# EAGLE design ChiefMarleySousViderev1 (EAGLE 5.11)
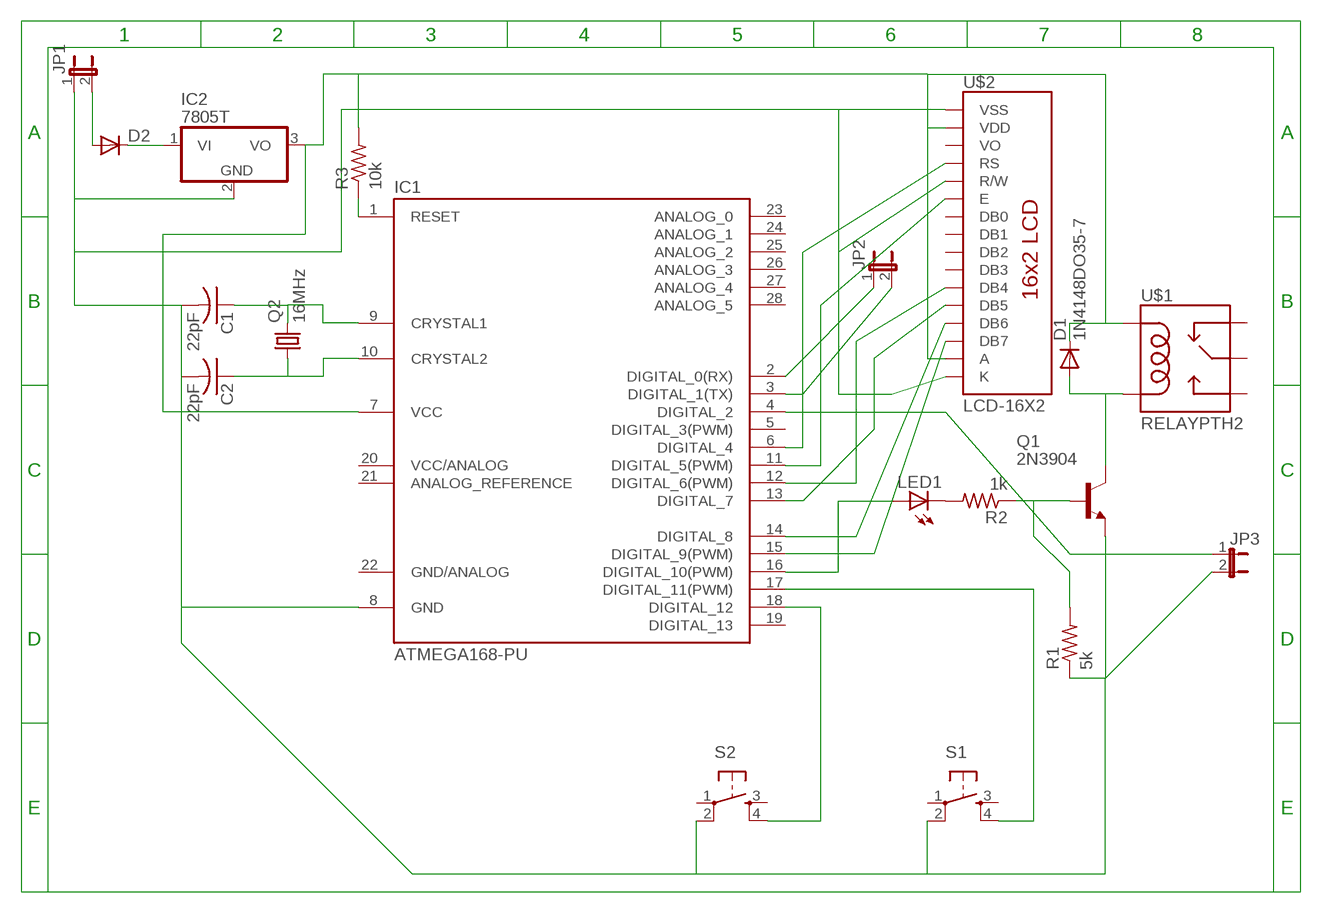
[diagram p0: schematic, sheet 1]

## Parts
C1  22pF  C-US025-025X050  [C025-025X050]
C2  22pF  C-US025-025X050  [C025-025X050]
D1  1N4148DO35-7  [DO35-7]
D2  DIODEPTH  [DIODE-1N4001]
IC1  ATMEGA168-PU  [DIL28-3]
IC2  7805T  [TO220H]
JP1  JUMPER-2PTH  [1X02]
JP2  JUMPER-2PTH  [1X02]
JP3  JP1E  [JP1]
LED1  LED3MM  [LED3MM]
Q1  2N3904  [TO92]
Q2  16MHz  CRYSTALHC49US  [HC49US]
R1  5k  R-US_0204/7  [0204/7]
R2  1k  R-US_0204/7  [0204/7]
R3  10k  R-US_0207/10  [0207/10]
S1  TAC_SWITCHPTH  [TACTILE-PTH]
S2  TAC_SWITCHPTH  [TACTILE-PTH]
U$1  RELAYPTH2  [RELAY-T9A]
U$2  LCD-16X2  [LCD-16X2]

## Nets
N$1: D1.A Q1.1(C) U$1.COIL2
N$2: D1.C IC1.7(VCC) IC2.3(VO) R3.2 U$1.COIL1 U$2.2(VDD) U$2.15(A)
N$3: Q1.2(B) R1.2 R2.1
N$4: IC1.2(DIGITAL_0(RX)) JP2.1
N$5: D2.A JP1.2
N$6: C1.1 IC1.9(CRYSTAL1) Q2.2
N$7: C2.1 IC1.10(CRYSTAL2) Q2.1
N$8: IC1.12(DIGITAL_6(PWM)) U$2.11(DB4)
N$9: IC1.6(DIGITAL_4) U$2.4(RS)
N$10: LED1.K(C) R2.2
N$11: IC1.18(DIGITAL_12) S2.4
N$12: IC1.17(DIGITAL_11(PWM)) S1.4
N$13: IC1.16(DIGITAL_10(PWM)) LED1.A
N$14: IC1.11(DIGITAL_5(PWM)) U$2.6(E)
N$15: IC1.13(DIGITAL_7) U$2.12(DB5)
N$16: IC1.14(DIGITAL_8) U$2.13(DB6)
N$17: IC1.15(DIGITAL_9(PWM)) U$2.14(DB7)
N$18: IC1.4(DIGITAL_2) JP3.1
N$19: IC1.1(RESET) R3.1
N$20: D2.C IC2.1(VI)
N$21: C1.2 C2.2 IC1.8(GND) IC2.2(GND) JP1.1 JP3.2 Q1.3(E) R1.1 S1.2 S2.2 U$2.1(VSS) U$2.5(R/W) U$2.16(K)
N$22: IC1.3(DIGITAL_1(TX)) JP2.2
Unconnected: IC1.5(DIGITAL_3(PWM)) IC1.19(DIGITAL_13) IC1.20(VCC/ANALOG) IC1.21(ANALOG_REFERENCE) IC1.23(ANALOG_0) IC1.24(ANALOG_1) IC1.25(ANALOG_2) IC1.26(ANALOG_3) IC1.27(ANALOG_4) IC1.28(ANALOG_5) S1.1 S1.3 S2.1 S2.3 U$1.MAIN U$1.NC U$1.NO U$2.3(VO) U$2.7(DB0) U$2.8(DB1) U$2.9(DB2) U$2.10(DB3)

## Power pins joined to a net without a drawn wire
GND/ANALOG: IC1.22(GND/ANALOG)

## Library data of the parts
C1 C2 = rcl:C-US: CAPACITOR, American symbol
D1 = diode:1N4148: DIODE high speed (Philips)
D2 = SparkFun:DIODE: Diode These are standard reverse protection diodes and small signal diodes. SMA package can handle up to about 1A. SOD-323 can handle about 200mA. What the SOD-323 package when ordering, there are some mfgs out there that are 5-pin packages.
IC1 = Arduino-AVR:ATMEGA168-PU
IC2 = linear:78*: Positive VOLTAGE REGULATOR Source: http://cache.national.com/ds/LM/LM78L05.pdf http://www.fairchildsemi.com/ds/LM/LM7805.pdf
JP1 JP2 = SparkFun:JUMPER-2: Jumper Basic 0.1" spaced jumper. Use with breakaway headers.
JP3 = jumper:JP1E: JUMPER
LED1 = SparkFun:LED: LEDs Standard schematic elements and footprints for 5mm, 3mm, 1206, and 0603 sized LEDs. 5mm - Spark Fun Electronics SKU : COM-00529 (and others)
Q1 = transistor-npn:2N3904: NPN Transistor
Q2 = SparkFun:CRYSTAL: Crystals Various standard crystals. Proven footprints. Spark Fun Electronics SKU : COM-00534
R1 R2 = rcl:R-US_: RESISTOR, American symbol
R3 = resistor:R-US_: RESISTOR, American symbol
S1 S2 = SparkFun:TAC_SWITCH: Momentary Switch Button commonly used for reset or general input. Spark Fun Electronics SKU : COM-00097
U$1 = SparkFun:RELAY
U$2 = SparkFun:LCD-16X2

## Board
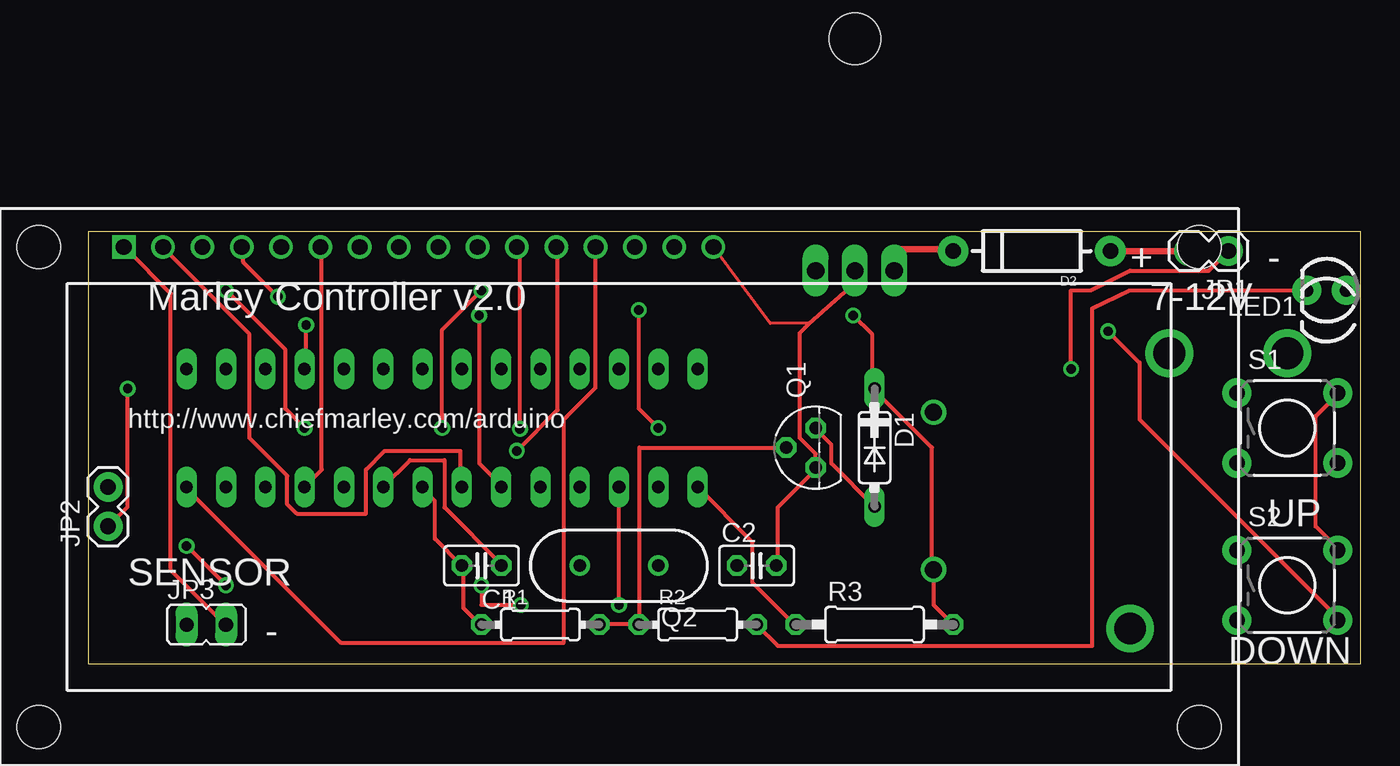
[diagram p1: board, top side]
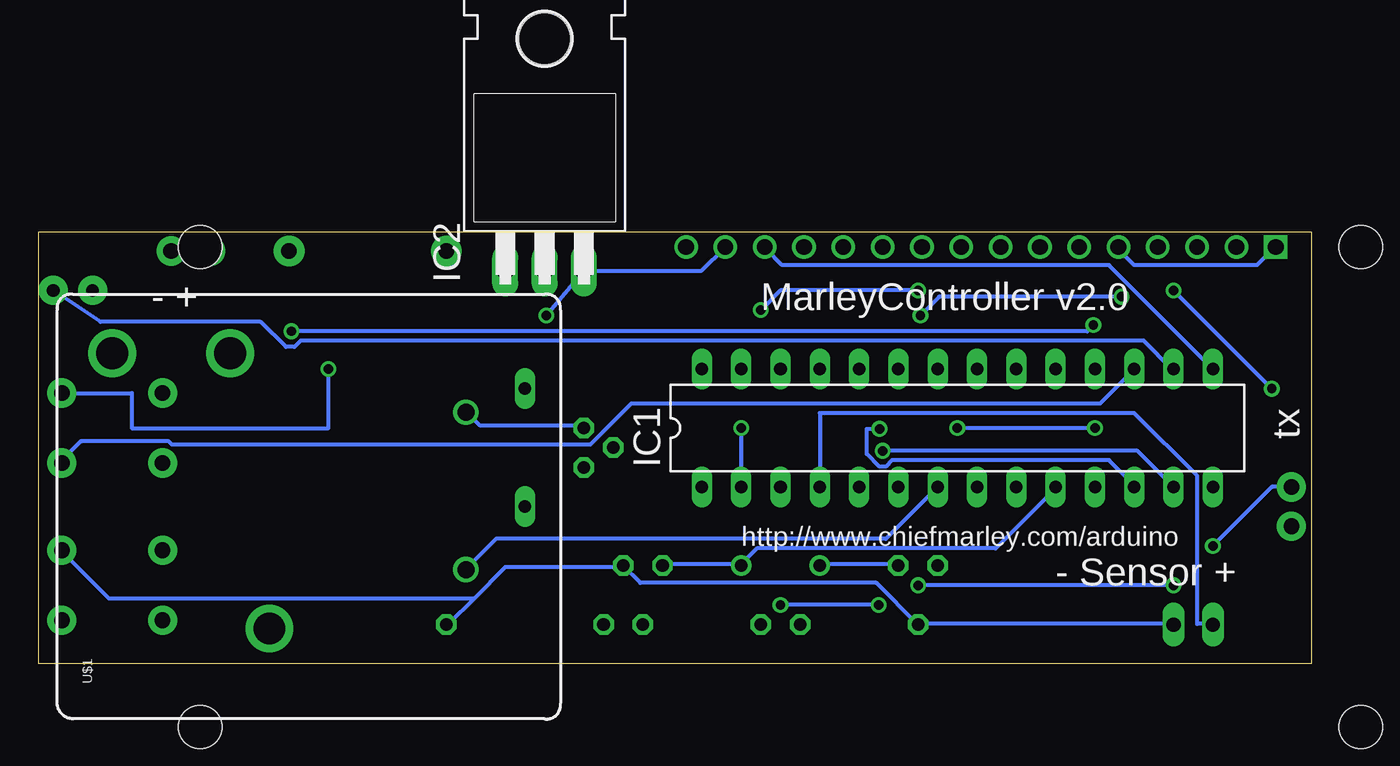
[diagram p2: board, bottom side, seen from below]

Size 82.22 x 27.93 mm. Coordinates in mm from the lower left corner, seen from the top.
Outline: 0,0 82.22,0 82.22,27.93 0,27.93 0,0
Copper layers (1*16): Top 0.035mm / dielectric 1.5mm / Bottom 0.035mm
Design rules "default": minimum track width 10mil, minimum drill 24mil, track to track 8mil, track to pad 8mil, pad to pad 8mil, via to via 8mil, smd to smd 8mil, copper to edge 40mil, drill to drill 8mil, minimum pad ring 10mil, minimum via ring 8mil, stop-mask expansion 4mil, vias tented up to drill 0mil, thermal gap 10mil

### Footprints (pad centres in the part's own frame; a part is rotated, then mirrored left to right if it is on the bottom)
C025-025X050 = drill 0.813 octagon: 1 -1.27,0; 2 1.27,0
DO35-7 = drill 0.813 long: A 3.81,0; C -3.81,0
DIODE-1N4001 = drill 1 pad 1.981 round: A -5.08,0; C 5.08,0
DIL28-3 = drill 0.813 long: 1 -16.51,-3.81; 2 -13.97,-3.81; 3 -11.43,-3.81; 4 -8.89,-3.81; 5 -6.35,-3.81; 6 -3.81,-3.81; 7 -1.27,-3.81; 8 1.27,-3.81; 9 3.81,-3.81; 10 6.35,-3.81; 11 8.89,-3.81; 12 11.43,-3.81; 13 13.97,-3.81; 14 16.51,-3.81; 15 16.51,3.81; 16 13.97,3.81; 17 11.43,3.81; 18 8.89,3.81; 19 6.35,3.81; 20 3.81,3.81; 21 1.27,3.81; 22 -1.27,3.81; 23 -3.81,3.81; 24 -6.35,3.81; 25 -8.89,3.81; 26 -11.43,3.81; 27 -13.97,3.81; 28 -16.51,3.81
TO220H = drill 1.118 long: 1 -2.54,-10.16; 2 0,-10.16; 3 2.54,-10.16 | hole 3.302: 0,4.826
1X02 = drill 1.016 pad 1.88 round: 1 0,0; 2 2.54,0
JP1 = drill 0.914 long: 1 0,-1.27; 2 0,1.27
LED3MM = drill 0.813 pad 1.88 round: A -1.27,0; K 1.27,0
TO92 = drill 0.813 octagon: 1 1.27,0; 2 0,1.905; 3 -1.27,0
HC49US = drill 0.813 round: 1 -2.54,0; 2 2.54,0
0204/7 = drill 0.813 octagon: 1 -3.81,0; 2 3.81,0
0207/10 = drill 0.813 octagon: 1 -5.08,0; 2 5.08,0
TACTILE-PTH = drill 1.016 pad 1.88 round: 1 -3.251,2.261; 2 3.251,2.261; 3 -3.251,-2.261; 4 3.251,-2.261
RELAY-T9A = drill 1.092 round: COIL1 -4.064,-10.16; COIL2 6.096,-10.16 | drill 2.057 round: MAIN -7.874,2.54; NC 9.906,12.7; NO 9.906,5.08
LCD-16X2 = drill 1.016 square: 1 -32,15.5 | drill 1.016 round: 2 -29.46,15.5; 3 -26.92,15.5; 4 -24.38,15.5; 5 -21.84,15.5; 6 -19.3,15.5; 7 -16.76,15.5; 8 -14.22,15.5; 9 -11.68,15.5; 10 -9.14,15.5; 11 -6.6,15.5; 12 -4.06,15.5; 13 -1.52,15.5; 14 1.02,15.5; 15 3.56,15.5; 16 6.1,15.5 | hole 2.8: -37.5,15.5; -37.5,-15.5; 37.5,15.5; 37.5,-15.5

### Placement (x,y rotation side)
C1  25.4,6.35 180 top
C2  43.18,6.35 0 top
D1  50.8,13.97 270 top
D2  60.96,26.67 180 top
IC1  22.86,15.24 0 bottom
IC2  49.53,35.56 0 bottom
JP1  73.66,26.67 180 top
JP2  1.27,8.89 90 top
JP3  7.62,2.54 270 top
LED1  80.01,24.13 180 top
Q1  46.99,13.97 90 top
Q2  34.29,6.35 180 top
R1  29.21,2.54 0 top
R2  39.37,2.54 0 top
R3  50.8,2.54 0 top
S1  77.47,15.24 0 top
S2  77.47,5.08 0 top
U$1  64.77,10.16 90 bottom
U$2  34.29,11.43 0 top

### Tracks (layer width: path | path; a pad name or v marks a point on that pad's centre or on a via)
N$1
  Top 0.254: D1.A 48.01,12.95 48.01,14.17 46.99,15.19 Q1.1
  Bottom 0.254: U$1.COIL2 54.51,16.2 53.7,15.39 46.99,15.39 Q1.1
N$2  (via drill 0.61)
  Top 0.254: U$1.COIL1 54.51,6.25 54.51,13.97 50.85,17.63 D1.C 50.65,17.83 50.65,21.29 v49.43,22.5 | U$2.2 4.93,26.77 10.41,21.29 10.41,14.58 12.85,12.14 12.85,10.31 13.46,9.7 17.93,9.7 17.93,12.55 19.15,13.77 24.03,13.77 24.03,11.53 IC1.7 | R3.2 54.61,3.81 U$1.COIL1 | U$1.COIL1 54.61,6.35
  Bottom 0.254: IC1.7 27.48,8.08 52.68,8.08 54.51,6.25 U$1.COIL1 | v49.43,22.5 IC2.3 39.38,25.4 U$2.15
N$3
  Top 0.254: R1.2 33.17,2.59 35.41,2.59 R2.1 35.61,2.59 35.61,13.97 Q1.2
N$4  (via drill 0.61)
  Top 0.254: v36.83,15.24 35.56,16.51 v35.56,22.86 | v25.4,24.13 22.86,21.59 v22.86,15.24 | v13.97,15.24 12.7,16.51 12.7,20.32 v8.89,24.13 | v2.54,17.78 2.54,10.16 JP2.1
  Bottom 0.254: v36.83,15.24 IC1.2 | v35.56,22.86 34.29,24.13 v25.4,24.13 | v13.97,15.24 v22.86,15.24 | v2.54,17.78 v8.89,24.13
N$5
  Top 0.406: D2.A JP1.2
N$6
  Top 0.254: IC1.9 20.78,13.16 23.01,13.16 23.01,10.11 26.67,6.45 C1.1
  Bottom 0.254: C1.1 26.67,6.45 31.75,6.45 Q2.2
N$7
  Bottom 0.254: 36.83,6.45 41.91,6.45 C2.1 | 36.83,6.45 35.81,7.47 20.37,7.47 16.51,11.33 IC1.10 | 36.83,6.45 Q2.1
N$8  (via drill 0.61)
  Top 0.254: v27.89,15.19 27.89,26.77 U$2.11
  Bottom 0.254: v27.89,15.19 28.7,15.19 28.7,13.56 27.89,12.75 27.48,12.75 27.08,13.16 13.06,13.16 11.43,11.53 IC1.12
N$9  (via drill 0.61)
  Top 0.254: v25.25,22.5 25.25,12.95 26.67,11.53 IC1.6 | v12.24,23.72 10.01,25.96 10.01,26.77 U$2.4
  Bottom 0.254: v25.25,22.5 24.03,23.72 v12.24,23.72
N$10
  Top 0.254: R2.2 44.55,1.17 64.87,1.17 64.87,22.96 67.31,24.13 LED1.K
N$11  (via drill 0.61)
  Top 0.254: v14.07,21.9 14.07,19.05 IC1.18 | v65.89,21.49 67.92,19.46 67.92,15.8 80.72,3 S2.4
  Bottom 0.254: v14.07,21.9 14.48,21.49 v65.89,21.49
N$12
  Bottom 0.254: IC1.17 13.66,16.81 43.94,16.81 46.58,14.17 73.61,14.17 73.81,14.38 79.5,14.38 80.72,13.16 S1.4
N$13
  Bottom 0.254: IC1.16 8.99,19.05 10.82,20.88 65.28,20.88 65.68,20.47 66.24,20.47 67.87,22.1 78.23,22.1 LED1.A
N$14
  Top 0.254: IC1.11 15.09,12.55 15.09,26.77 U$2.6
N$15  (via drill 0.61)
  Top 0.254: v27.69,13.77 30.33,16.41 30.33,26.77 U$2.12
  Bottom 0.254: v27.69,13.77 11.23,13.77 IC1.13
N$16
  Top 0.254: IC1.14 6.35,11.33 16.31,1.37 30.73,1.37 30.73,15.8 32.77,17.83 32.77,26.77 U$2.13
N$17
  Bottom 0.254: IC1.15 13.06,25.76 34.19,25.76 35.2,26.77 U$2.14
N$18
  Bottom 0.254: IC1.4 31.75,16.2 11.43,16.2 7.37,12.14 7.37,2.59 6.35,2.59 JP3.1
N$19
  Top 0.254: R3.1 45.57,2.59 42.93,5.23 42.93,7.87 IC1.1
N$20
  Top 0.406: D2.C 55.73,26.77 52.07,26.77 IC2.1
N$21  (via drill 0.6)
  Top 0.203: 49.43,24.54 IC2.2 | 46.58,22 44.05,22 U$2.16
  Top 0.254: R1.1 25.25,2.59 24.23,3.61 24.23,6.25 C1.2 22.4,8.08 22.4,10.52 21.59,11.33 IC1.8 | U$2.1 2.49,26.77 5.33,23.93 5.33,6.04 8.79,2.59 JP3.2 | S2.2 80.72,7.47 79.3,8.89 79.3,16 80.72,17.42 S1.2 | 49.43,24.54 46.58,22 45.97,21.39 45.97,14.58 46.99,13.56 Q1.3 46.99,12.55 44.55,10.11 44.55,6.45 C2.2 | U$2.16 40.49,26.77 | v63.5,19.05 63.5,24.13 64.77,24.13 67.31,25.4 72.39,25.4 JP1.1
  Bottom 0.254: U$2.1 2.49,26.77 3.5,25.76 11.43,25.76 12.45,26.77 U$2.5 | JP3.2 8.99,2.59 25.25,2.59 R1.1 28.09,5.23 43.33,5.23 C2.2 44.55,6.25 52.07,6.25 54.1,4.22 | 54.1,4.22 55.73,2.59 | 54.1,4.22 77.67,4.22 80.72,7.26 S2.2 | S1.2 76.2,17.5 76.2,15.24 63.5,15.24 v63.5,19.05
N$22  (via drill 0.61)
  Top 0.254: v34.29,3.81 IC1.3 | v27.94,3.81 25.4,3.81 v25.4,5.08 | v6.35,7.62 v8.89,5.08
  Bottom 0.254: v27.94,3.81 v34.29,3.81 | v8.89,5.08 v25.4,5.08 | v6.35,7.62 2.54,11.43 JP2.2

### Text on the board
tPlace: + | - | Marley Controller v2.0 | 7-12V | http://www.chiefmarley.com/arduino | UP | SENSOR | - | DOWN
bPlace: MarleyController v2.0 | - + | tx | http://www.chiefmarley.com/arduino | - Sensor +
_tNames: D2 | JP1 | LED1 | S1 | S2
_tValues: 2N3904 | 16MHz | 22pF | 22pF | 5k | 1k | 10k